# Altium schematic sheet LTM8055.SchDoc
size A4
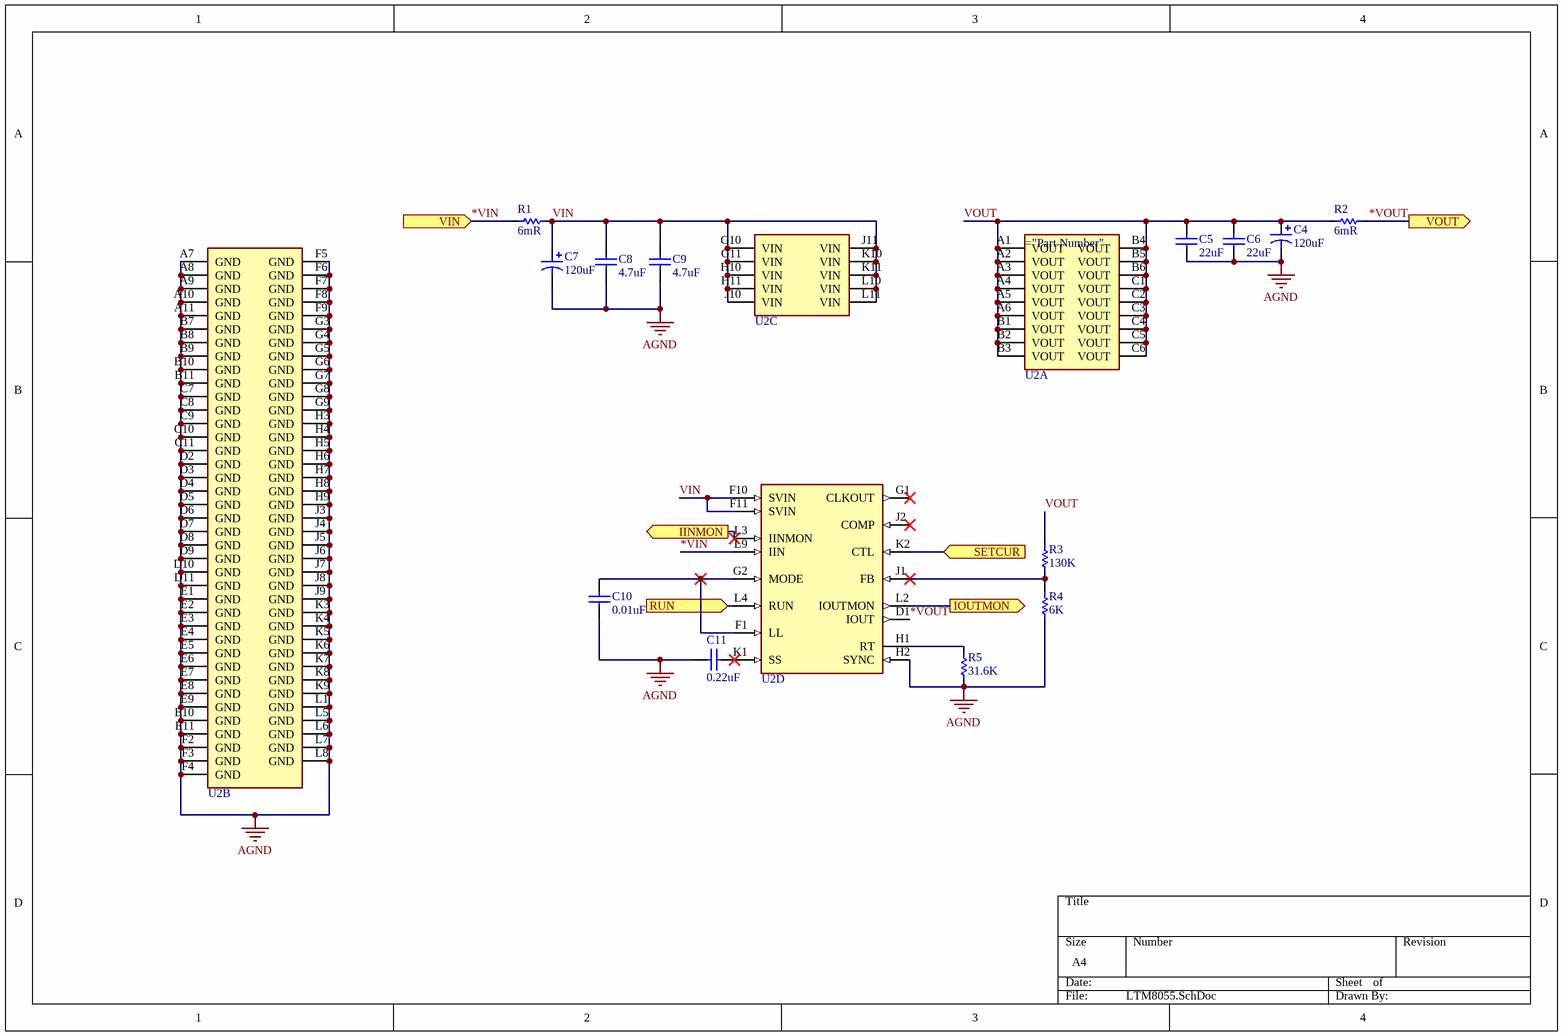
[diagram p0: LTM8055.SchDoc]

## Parts
C4  value 120uF  [CS 5.0*10*13 - C]  (hidden comment: Cap Pol1)
C5  value 22uF  [1210C]  (hidden comment: Cap)
C6  value 22uF  [1210C]  (hidden comment: Cap)
C7  value 120uF  [CS 5.0*10*13 - C]  (hidden comment: Cap Pol1)
C8  value 4.7uF  [1206C]  (hidden comment: Cap)
C9  value 4.7uF  [1206C]  (hidden comment: Cap)
C10  value 0.01uF  [0603C]  (hidden comment: Cap)
C11  value 0.22uF  [0603C]  (hidden comment: Cap)
R1  value 6mR  [R 2512_L]  (hidden comment: Res1)
R2  value 6mR  [R 2512_L]  (hidden comment: Res1)
R3  value 130K  [R 0603_L]  (hidden comment: Res1)
R4  value 6K  [R 0603_L]  (hidden comment: Res1)
R5  value 31.6K  [R 0603_L]  (hidden comment: Res1)
U2  LTM8055MPY#PBF  [DWG# 05-08-1891]  (value not drawn)  (parts A,B,C,D of 4)

## Ports
IINMON (out), IOUTMON (out), RUN (in), SETCUR (in), VIN (in), VOUT (out)

## Nets
AGND: C4.2 C5.1 C6.1 C7.2 C8.1 C9.1 C10.1 C11.2 R4.2 R5.2 U2.A7(GND) U2.A8(GND) U2.A9(GND) U2.A10(GND) U2.A11(GND) U2.B7(GND) U2.B8(GND) U2.B9(GND) U2.B10(GND) U2.B11(GND) U2.C7(GND) U2.C8(GND) U2.C9(GND) U2.C10(GND) U2.C11(GND) U2.D2(GND) U2.D3(GND) U2.D4(GND) U2.D5(GND) U2.D6(GND) U2.D7(GND) U2.D8(GND) U2.D9(GND) U2.D10(GND) U2.D11(GND) U2.E1(GND) U2.E2(GND) U2.E3(GND) U2.E4(GND) U2.E5(GND) U2.E6(GND) U2.E7(GND) U2.E8(GND) U2.E9(GND) U2.E10(GND) U2.E11(GND) U2.F2(GND) U2.F3(GND) U2.F4(GND) U2.F5(GND) U2.F6(GND) U2.F7(GND) U2.F8(GND) U2.F9(GND) U2.G3(GND) U2.G4(GND) U2.G5(GND) U2.G6(GND) U2.G7(GND) U2.G8(GND) U2.G9(GND) U2.H2(SYNC) U2.H3(GND) U2.H4(GND) U2.H5(GND) U2.H6(GND) U2.H7(GND) U2.H8(GND) U2.H9(GND) U2.J3(GND) U2.J4(GND) U2.J5(GND) U2.J6(GND) U2.J7(GND) U2.J8(GND) U2.J9(GND) U2.K3(GND) U2.K4(GND) U2.K5(GND) U2.K6(GND) U2.K7(GND) U2.K8(GND) U2.K9(GND) U2.L1(GND) U2.L5(GND) U2.L6(GND) U2.L7(GND) U2.L8(GND)
*VIN: R1.2 U2.L9(IIN) ; port VIN
*VOUT: R2.1 U2.D1(IOUT) ; port VOUT
IINMON: U2.L3(IINMON) ; port IINMON
IOUTMON: U2.L2(IOUTMON) ; port IOUTMON
RUN: U2.L4(RUN) ; port RUN
SETCUR: U2.K2(CTL) ; port SETCUR
VIN: C7.1 C8.2 C9.2 R1.1 U2.F10(SVIN) U2.F11(SVIN) U2.G10(VIN) U2.G11(VIN) U2.H10(VIN) U2.H11(VIN) U2.J10(VIN) U2.J11(VIN) U2.K10(VIN) U2.K11(VIN) U2.L10(VIN) U2.L11(VIN)
VOUT: C4.1 C5.2 C6.2 R2.2 R3.1 U2.A1(VOUT) U2.A2(VOUT) U2.A3(VOUT) U2.A4(VOUT) U2.A5(VOUT) U2.A6(VOUT) U2.B1(VOUT) U2.B2(VOUT) U2.B3(VOUT) U2.B4(VOUT) U2.B5(VOUT) U2.B6(VOUT) U2.C1(VOUT) U2.C2(VOUT) U2.C3(VOUT) U2.C4(VOUT) U2.C5(VOUT) U2.C6(VOUT)
NetC10_2: C10.2 U2.F1(LL) U2.G2(MODE)
NetC11_1: C11.1 U2.K1(SS)
NetR3_2: R3.2 R4.1 U2.J1(FB)
NetR5_1: R5.1 U2.H1(RT)

Not connected (* = marked no-connect by the designer): U2 G1(CLKOUT)* J2(COMP)*

## Library data of the parts
C4 C7 = Cap Pol1: Polarized Capacitor (Radial); Published: 8-Jun-2000; LatestRevisionDate: 17-Jul-2002; LatestRevisionNote: Re-released for DXP Platform.; PackageReference: RB7.6-15; Publisher: Altium Limited; PackageDescription: Polarized Capacitor (Radial); 2 Leads
C5 C6 C8-C11 = Cap: X5R 50V; Published: 8-Jun-2000; LatestRevisionDate: 17-Jul-2002; LatestRevisionNote: Re-released for DXP Platform.; PackageReference: RAD-0.3; Publisher: Altium Limited; PackageDescription: Radial Cap, Thru-Hole; 2 Leads; 0.3 in Pin Spacing
R1-R5 = Res1: Resistor; Published: 8-Jun-2000; LatestRevisionDate: 17-Jul-2002; LatestRevisionNote: Re-released for DXP Platform.; PackageReference: AXIAL-0.3; Publisher: Altium Limited; PackageDescription: Axial Device, Thru-Hole; 2 Leads; 0.3 in Pin Spacing